# Altium schematic sheet Receiver.SchDoc
size A4
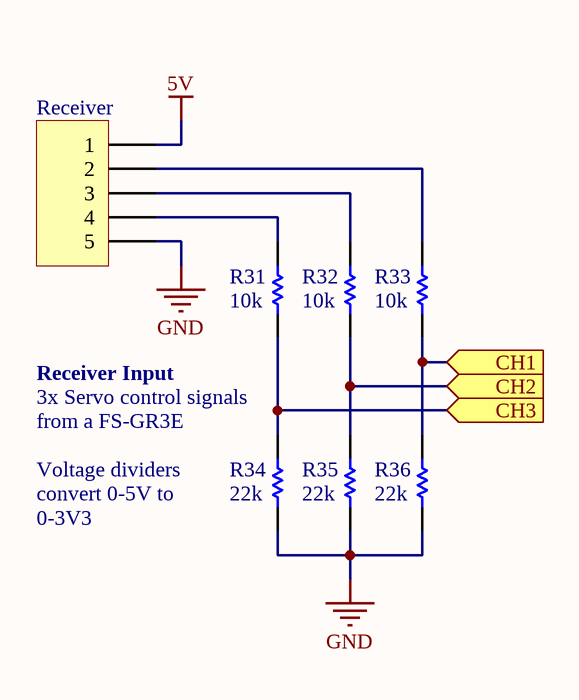
[diagram p0: Receiver.SchDoc]

## Parts
R31  value 10k  [J1-0603]  (hidden comment: Res1)
R32  value 10k  [J1-0603]  (hidden comment: Res1)
R33  value 10k  [J1-0603]  (hidden comment: Res1)
R34  value 22k  [J1-0603]  (hidden comment: Res1)
R35  value 22k  [J1-0603]  (hidden comment: Res1)
R36  value 22k  [J1-0603]  (hidden comment: Res1)
Receiver  (no value)  [HDR1X5]

## Ports
CH1 (in), CH2 (in), CH3 (in)

## Nets
5V: Receiver.1
GND: R34.1 R35.1 R36.1 Receiver.5
CH1: R33.1 R36.2 ; port CH1
CH2: R32.1 R35.2 ; port CH2
CH3: R31.1 R34.2 ; port CH3
NetR31_2: R31.2 Receiver.4
NetR32_2: R32.2 Receiver.3
NetR33_2: R33.2 Receiver.2

## Notes on the sheet
- Receiver Input
- 3x Servo control signals
- from a FS-GR3E
- (near R34) Voltage dividers
- (near R34) convert 0-5V to
- 0-3V3

## Library data of the parts
R31-R36 = Res1: Resistor; Published: 8-Jun-2000; LatestRevisionDate: 17-Jul-2002; LatestRevisionNote: Re-released for DXP Platform.; PackageReference: AXIAL-0.3; Publisher: Altium Limited; PackageDescription: Axial Device, Thru-Hole; 2 Leads; 0.3 in Pin Spacing
Receiver = Header 5: Receiver Input; LatestRevisionDate: 17-Jul-2002; LatestRevisionNote: Re-released for DXP Platform.; Publisher: Altium Limited